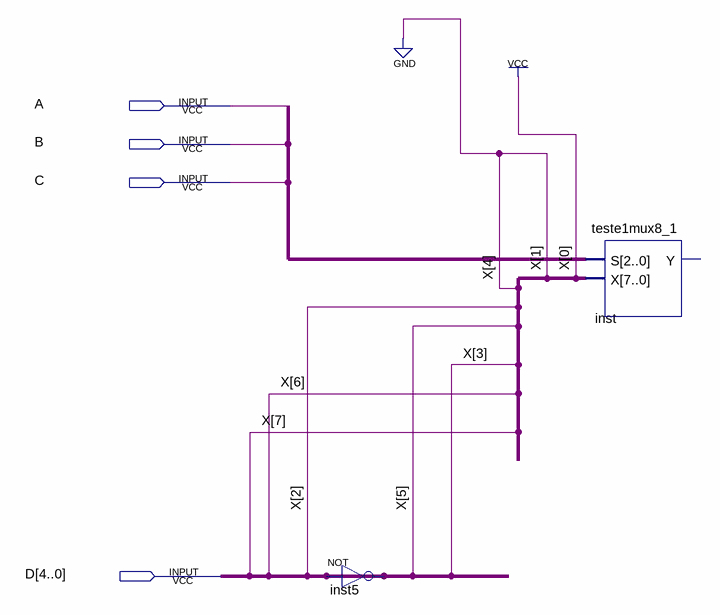
[diagram p0: schematic sheet]
// Quartus schematic funcao.bdf as structural Verilog: 2 symbols, 4 pins
module funcao (
  input  A,
  input  B,
  input  C,
  input  [4:0] D
);

  wire [2:0] undriven;
  wire [7:0] undriven_2;

  assign D = ~D;  // NOT inst5, 5 bits wide
  teste1mux8_1 inst (.S(undriven), .X(undriven_2));  // open: Y
endmodule
